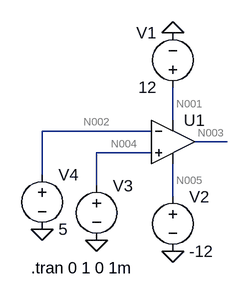
[diagram p0: schematic Draft1.asc]
Draft1.asc, the LTspice schematic file:
Version 4.1
SHEET 1 880 680
WIRE 176 144 176 96
WIRE 144 160 -16 160
WIRE 256 176 208 176
WIRE 144 192 64 192
WIRE -16 224 -16 160
WIRE 64 240 64 192
WIRE 176 256 176 208
FLAG 176 16 0
FLAG 176 336 0
FLAG 64 320 0
FLAG -16 304 0
SYMBOL OpAmps\\UniversalOpAmp2 176 176 R0
SYMATTR InstName U1
SYMBOL voltage 176 112 R180
WINDOW 0 24 96 Left 2
WINDOW 3 24 16 Left 2
WINDOW 123 0 0 Left 0
WINDOW 39 0 0 Left 0
SYMATTR InstName V1
SYMATTR Value 12
SYMBOL voltage 176 240 R0
WINDOW 123 0 0 Left 0
WINDOW 39 0 0 Left 0
SYMATTR InstName V2
SYMATTR Value -12
SYMBOL voltage 64 224 R0
WINDOW 3 24 96 Invisible 2
WINDOW 123 0 0 Left 0
WINDOW 39 0 0 Left 0
SYMATTR Value SINE(0 6 10)
SYMATTR InstName V3
SYMBOL voltage -16 208 R0
WINDOW 123 0 0 Left 0
WINDOW 39 0 0 Left 0
SYMATTR InstName V4
SYMATTR Value 5
TEXT -32 360 Left 2 !.tran 0 1 0 1m

The netlist it stands for:
* Draft1.asc
X§U1 N004 N002 N001 N005 N003 level2 Avol=1Meg GBW=10Meg Slew=10Meg Ilimit=25m Rail=0 Vos=0 En=0 Enk=0 In=0 Ink=0 Rin=500Meg  ; pins In+ In- V+ V- OUT
V1 N001 0 12
V2 N005 0 -12
V3 N004 0 SINE(0 6 10)
V4 N002 0 5
.tran 0 1 0 1m
.lib UniversalOpAmp2.lib
.backanno
.end

* Results of the author's LTspice run, read from the files saved beside the schematic
* Operating Point, zero values left out:
*   V(n001) = 12 V
*   V(n002) = 5 V
*   V(n003) = -12 V
*   V(n005) = -12 V
*   I(V1) = -2.687 µA
*   I(V2) = 2.452 µA
*   I(V4) = -10 nA
*   Ix(u1:2) = 10 nA
*   Ix(u1:3) = 2.687 µA
*   Ix(u1:4) = -2.452 µA
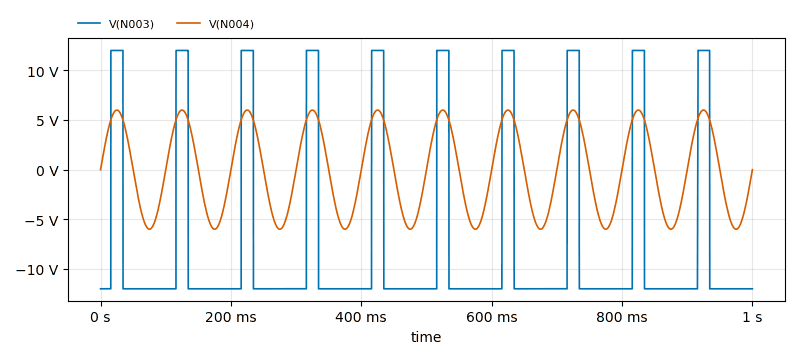
[diagram p1: Transient Analysis of Draft1.asc, plotted from the saved traces]
* Transient Analysis, 1 run:
*   V(N003): min -12 V, max 12.01 V, average -7.536 V, rms 12 V, last -12 V
*   V(N004): min -6 V, max 6 V, average 47.17 µV, rms 4.243 V, last 0 V